# Altium schematic sheet circuit de boost.schdoc
size A4; SheetNumber: 7; SheetTotal: 7
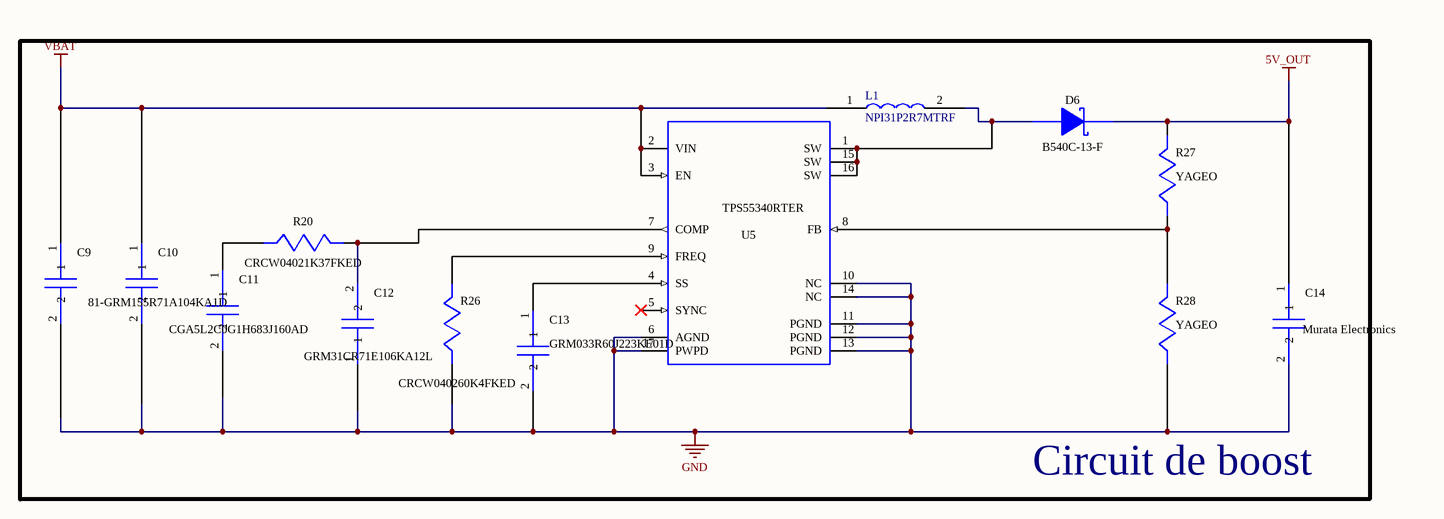
[diagram p0: circuit de boost.schdoc]

## Parts
C9  GRM31CR71E106KA12L  [GRM31CR71E106KA12L]  (value not drawn)
C10  Supplier réf: 81-GRM155R71A104KA1D  [GRM155R71A104KA01D]  (hidden comment: GRM155R71A104KA01D)
C11  CGA5L2C0G1H683J160AD  [CGA5L2C0G1H683J160AD]
C12  Mfr réf: GRM31CR71E106KA12L  [GRM2195C1H152JA01L]  (hidden comment: GRM2195C1H152JA01D)
C13  GRM033R60J223KE01D  [GRM033R60J223KE01D]
C14  Mfr: Murata Electronics  [GRM32EC80J107ME20L]  (hidden comment: GRM32EC80J107ME20L)
D6  B540C-13-F  [B540C-13-F]
L1  NPI31P2R7MTRF  [NPI31P2R7MTRF]
R20  CRCW04021K37FKED  [CRCW04021K37FKED]
R26  CRCW040260K4FKED  [CRCW040260K4FKED]
R27  Mfr: YAGEO  [RT0805BRD0730K5L]  (hidden comment: RT0805BRD0730K5L)
R28  Mfr: YAGEO  [RC0201FR-0710KL]  (hidden comment: RC0201FR-0710KL)
U5  TPS55340RTER  [TPS55340RTER]

## Blocks framed on the sheet
Circuit de boost: C9-C14 D6 L1 R20 R26-R28 U5

## Nets
5V_OUT: C14.1 D6.1(K) R27.1
GND: C9.2 C10.2 C11.2 C12.1 C13.2 C14.2 R26.2 R28.2 U5.6(AGND) U5.10(NC) U5.11(PGND) U5.12(PGND) U5.13(PGND) U5.14(NC) U5.17(PWPD)
VBAT: C9.1 C10.1 L1.1 U5.2(VIN) U5.3(EN)
NetC11_1: C11.1 R20.2
NetC12_2: C12.2 R20.1 U5.7(COMP)
NetC13_1: C13.1 U5.4(SS)
NetD6_2: D6.2(A) L1.2 U5.1(SW) U5.15(SW) U5.16(SW)
NetR26_1: R26.1 U5.9(FREQ)
NetR27_2: R27.2 R28.1 U5.8(FB)

Not connected (* = marked no-connect by the designer): U5 5(SYNC)*

## Library data of the parts
C9 = GRM31CR71E106KA12L: Multilayer Ceramic Capacitors MLCC - SMD/SMT 10 uF 25 VDC 10% 1206 X7R; Mfr: MuRata; Mfr réf: GRM31CR71E106KA12L; Supplier: Mouser; Supplier réf: 81-GRM31CR71E106KA12; Footprint: C1206; Price: 0.29$
C10 = GRM155R71A104KA01D: Multilayer Ceramic Capacitors MLCC - SMD/SMT 0.1 uF 10 VDC 10% 0402 X7R; Mfr: Murata; Mfr réf: GRM155R71A104KA01D; Supplier: mouser; Price: 0.09$
C11 = CGA5L2C0G1H683J160AD: Multilayer Ceramic Capacitors MLCC - SMD/SMT 1206 50V 0.068uF C0G 5% AEC-Q200 EPXY; Mfr: TDK; Supplier: mouser; Supplier réf: 810-CGA5L2C0G1H683JD; Mfr réf: CGA5L2C0G1H683J160AD; Footprint: *; Price: 0.73$
C12 = GRM2195C1H152JA01D: Multilayer Ceramic Capacitors MLCC - SMD/SMT 10 uF 25 VDC 10% 1206 X7R; Mfr: MuRata; Supplier: mouser; Supplier réf: 490-6518-6-ND; Price: 0.29$
C13 = GRM033R60J223KE01D: Multilayer Ceramic Capacitors MLCC - SMD/SMT 0.022 uF 6.3 VDC 10% 0201 X5R; Mfr: MuRata; Supplier: Mouser; Supplier réf: 81-GRM033R60J223KE1D; Mfr réf: GRM033R60J223KE01D; Price: 0.09$
C14 = GRM32EC80J107ME20L: Multilayer Ceramic Capacitors MLCC - SMD/SMT 100 uF 6.3 VDC 20% 1210 X6S; Supplier: Mouser; Supplier réf: 81-GRM32EC80J107ME0L; Mfr réf: GRM32EC80J107ME20L; Footprint: C1210; Price: 1.33$
D6 = B540C-13-F: Schottky Diodes & Rectifiers 40V 5A; Mfr: Diodes Incorporated; Supplier: Mouser; Supplier réf: 621-B540C-F; Mfr réf: B540C-13-F; Footprint: B540C; Price: 0.43$
L1 = NPI31P2R7MTRF: Power Inductor (SMD), 2.7 uH, ± 20%, 6.6 A, Unshielded, 7 A, 13.2mm x 9.9mm x 6.4mm; Mfr: NIC; Supplier: Exshine Technology; Supplier réf: EX-NPI31P2R7MTRF; Mfr réf: NPI31P2R7MTRF; Price: 0.37$
R20 = CRCW04021K37FKED: Thick Film Resistors - SMD 1/16watt 1.37Kohms 1%; Mfr: Vishay Dale; Supplier: mouser; Supplier réf: 71-CRCW0402-1.37K-E3; Mfr réf: CRCW04021K37FKED; Price: 0.093$
R26 = CRCW040260K4FKED: Thick Film Resistors - SMD 1/16watt 60.4Kohms 1%; Mfr: Vishay-Dale; Supplier: Digikey; Supplier réf: 541-60.4KLDKR-ND; Mfr réf: CRCW040260K4FKED; Price: 0.10$
R27 = RT0805BRD0730K5L: Thin Film Resistors - SMD 1/8W 30.5K Ohms 0.1%; Supplier: Mouser; Supplier réf: 603-RT0805BRD0730K5L; Mfr réf: RT0805BRD0730K5L; Footprint: R0805; Price: 0.15$
R28 = RC0201FR-0710KL: Thick Film Resistors - SMD 10 kOhms 50mW 0201 1%; Supplier: mouser; Supplier réf: 603-RC0201FR-0710KL; Mfr réf: RC0201FR-0710KL; Footprint: RC0201; Price: 0.09$
U5 = TPS55340RTER: Switching Voltage Regulators 5A 40V Wide In Range DC-DC Converter; Mfr: Texas Instruments; Supplier réf: 595-TPS55340RTER; Mfr réf: TPS55340RTER; Price: 15$